# Altium schematic sheet Remote.SchDoc
size A4; SheetNumber: 8; SheetTotal: 8
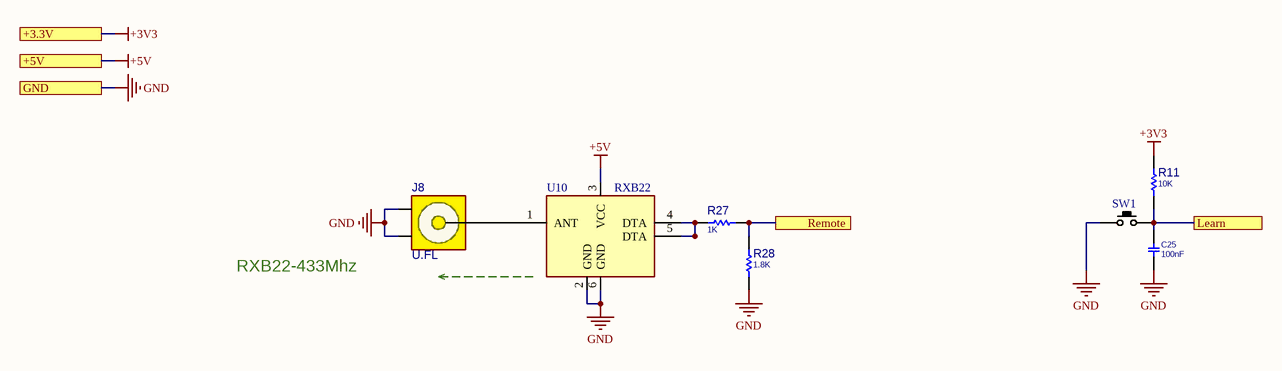
[diagram p0: Remote.SchDoc]

## Parts
C25  100nF  [C0805]
J8  U.FL  [UFL]
R11  10K  [R0805]
R27  1K  [R0805]
R28  1.8K  [R0805]
SW1  Tactile Switch  [Tactile Switch]  (value not drawn)
U10  RXB22  [RXB22]

## Ports
+3.3V, +5V, GND, Learn, Remote

## Nets
+3V3: R11.1 ; port +3.3V
+5V: U10.3(VCC) ; port +5V
GND: C25.1 J8.2(G1) J8.3(G2) R28.1 SW1.1(P1) U10.2(GND) U10.6(GND) ; port GND
Learn: C25.2 R11.2 SW1.2(P3) ; port Learn
Remote: R27.2 R28.2 ; port Remote
NetJ8_1: J8.1(SIG) U10.1(ANT)
NetR27_1: R27.1 U10.4(DTA) U10.5(DTA)

## Notes on the sheet
- RXB22-433Mhz

## Library data of the parts
C25 = CAP_SMD_MLCC_0805: CAP, MLCC, -F, -V, MATERIAL, -%, 0201; PARAM: -, -%; MANF_P#: MANF_PART#; PRICE: 100= 1$; MANF: -; PARAM2: -V; ASSEMBLY: ASSEMBLY; VALUE: 100nF
J8 = CONN_RF_UFL: CONN, RF, U.FL, STRAIGHT, Ultra Miniature Coaxial; MANF_P#: CONUFL001-SMD, U.FL-R-SMT-1(10), 128-0711-201; MANF: Linx, Hirose, Cinch; PARAM: 50Ohm, 6GHz; DESC: DESCRIPTION; DIST#: DIGIKEY, MOUSER; PARAM2: GOLD; ASSEMBLY: ASSEMBLY; PRICE: 0.9$; VALUE: U.FL
R11 R27 R28 = RES_SMD_0805: RESISTOR, SMD; PARAM: -W; DESC: DESCRIPTION; DIST#: MOUSER; PARAM2: 1%; MANF_P#: -; MANF: -; ASSEMBLY: ASSEMBLY; PRICE: 100= 0.5$
  R11: VALUE: 10K
  R27: VALUE: 1K
  R28: VALUE: 1.8K
SW1 = Tactile Switch: 3x6x5 mm - 2 Pin
U10 = RXB22: RF Receiver 433Mhz